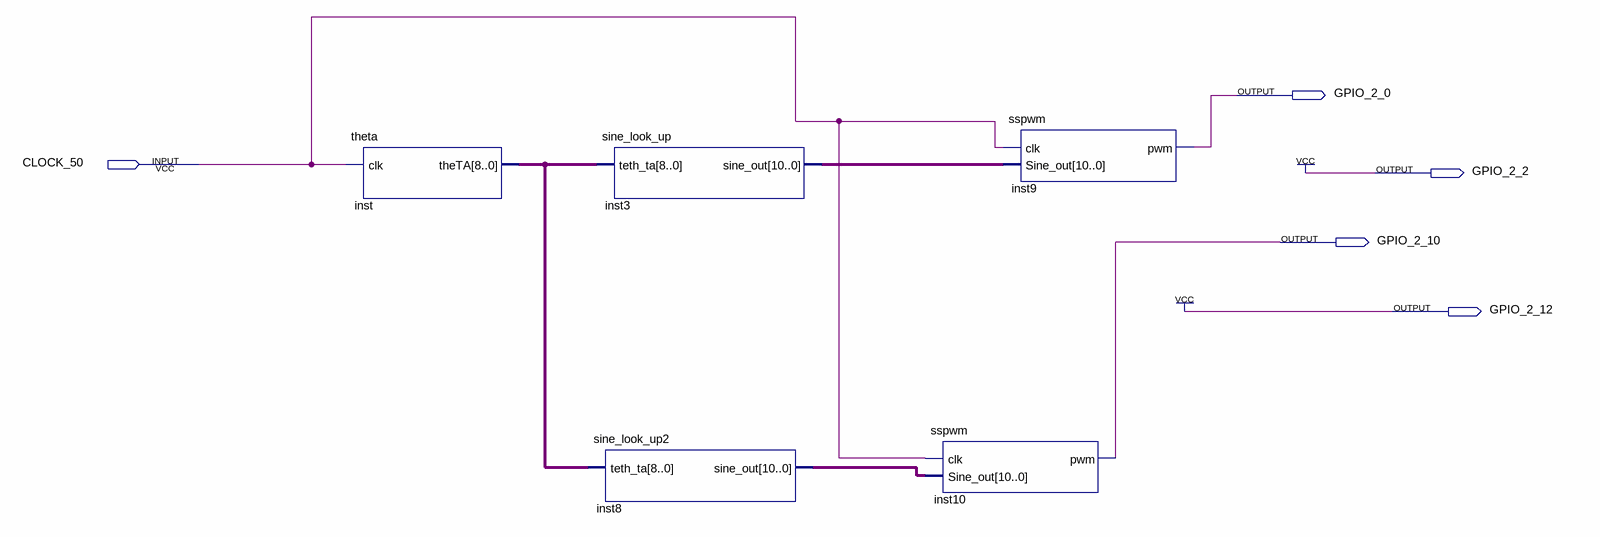
[diagram p0: schematic sheet]
// Quartus schematic test.bdf as structural Verilog: 5 symbols, 5 pins
module test (
  input  CLOCK_50,
  output GPIO_2_0,
  output GPIO_2_2,
  output GPIO_2_10,
  output GPIO_2_12
);

  wire [8:0] inst_theta;
  wire [10:0] inst3_sine_out, inst8_sine_out;

  theta inst (.clk(CLOCK_50), .theTA(inst_theta));
  sine_look_up inst3 (.teth_ta(inst_theta), .sine_out(inst3_sine_out));
  sine_look_up2 inst8 (.teth_ta(inst_theta), .sine_out(inst8_sine_out));
  sspwm inst10 (.clk(CLOCK_50), .Sine_out(inst8_sine_out), .pwm(GPIO_2_10));
  sspwm inst9 (.clk(CLOCK_50), .Sine_out(inst3_sine_out), .pwm(GPIO_2_0));

  assign GPIO_2_2 = 1'b1;
  assign GPIO_2_12 = 1'b1;
endmodule
